# Altium schematic sheet power.SchDoc
size A4; Organization: Altium Limited; Address1: L3, 12a Rodborough Rd; Address2: Frenchs Forest; Address3: NSW; Address4: Australia 2086; SheetNumber: 6; SheetTotal: 8
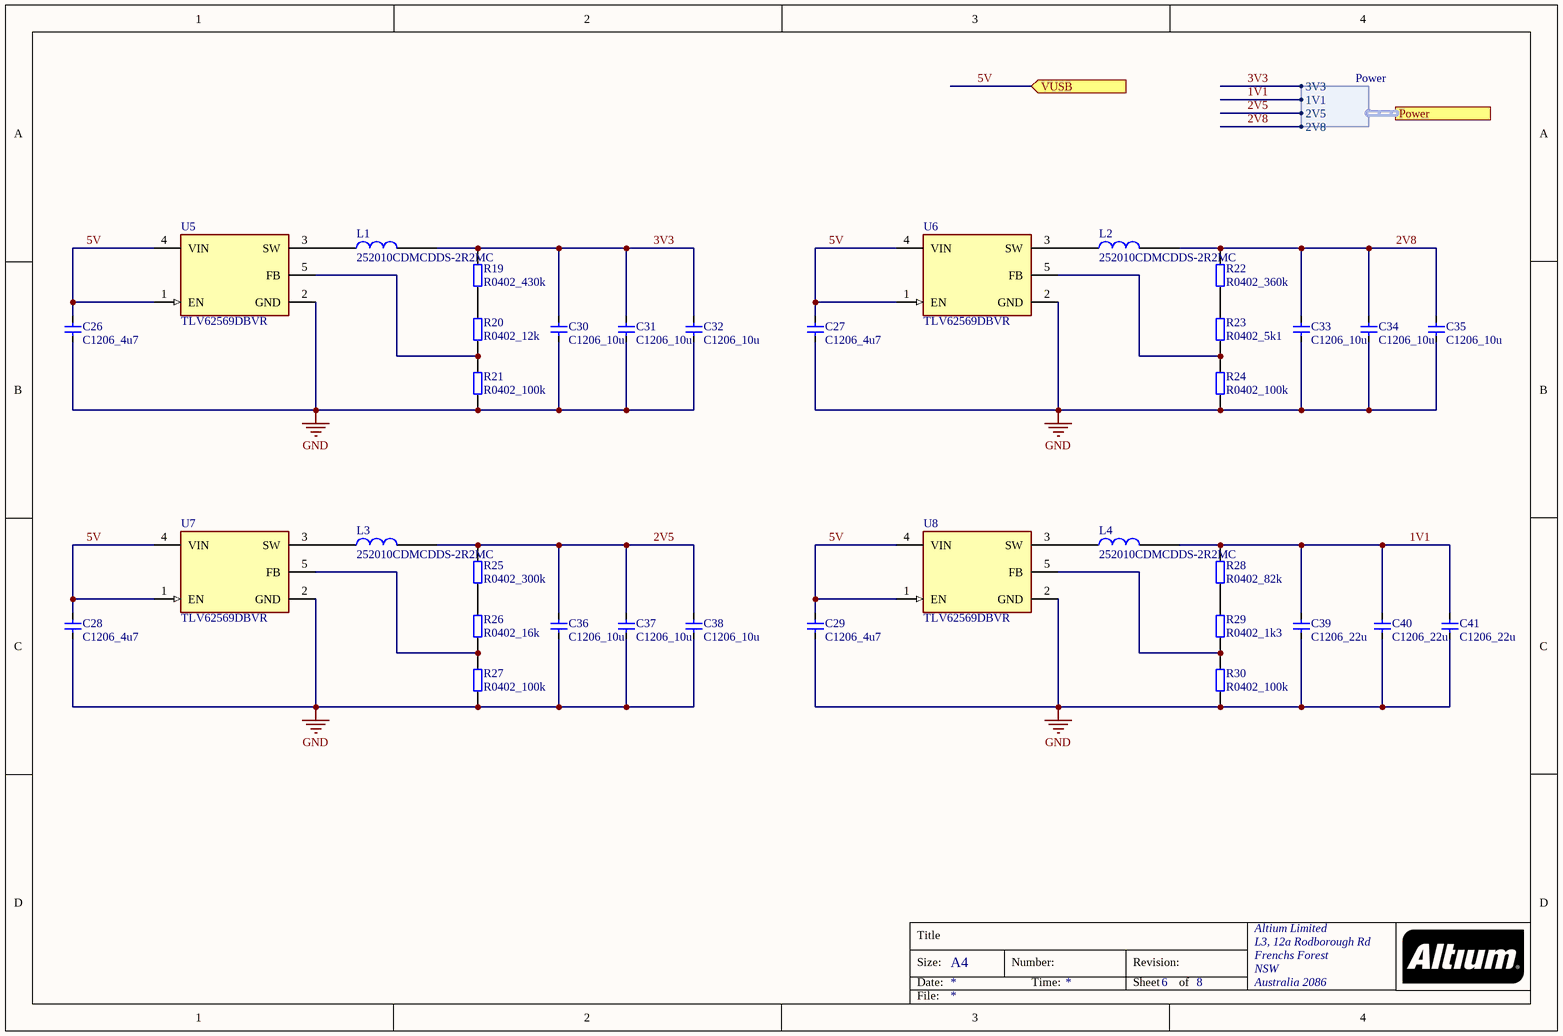
[diagram p0: power.SchDoc]

## Parts
C26  C1206_4u7  [C1206]
C27  C1206_4u7  [C1206]
C28  C1206_4u7  [C1206]
C29  C1206_4u7  [C1206]
C30  C1206_10u  [C1206]
C31  C1206_10u  [C1206]
C32  C1206_10u  [C1206]
C33  C1206_10u  [C1206]
C34  C1206_10u  [C1206]
C35  C1206_10u  [C1206]
C36  C1206_10u  [C1206]
C37  C1206_10u  [C1206]
C38  C1206_10u  [C1206]
C39  C1206_22u  [C1206]
C40  C1206_22u  [C1206]
C41  C1206_22u  [C1206]
L1  252010CDMCDDS-2R2MC  [INDC2520X10N]
L2  252010CDMCDDS-2R2MC  [INDC2520X10N]
L3  252010CDMCDDS-2R2MC  [INDC2520X10N]
L4  252010CDMCDDS-2R2MC  [INDC2520X10N]
R19  R0402_430k  [R0402]
R20  R0402_12k  [R0402]
R21  R0402_100k  [R0402]
R22  R0402_360k  [R0402]
R23  R0402_5k1  [R0402]
R24  R0402_100k  [R0402]
R25  R0402_300k  [R0402]
R26  R0402_16k  [R0402]
R27  R0402_100k  [R0402]
R28  R0402_82k  [R0402]
R29  R0402_1k3  [R0402]
R30  R0402_100k  [R0402]
U5  TLV62569DBVR  [FP-DBV0005A-MFG]
U6  TLV62569DBVR  [FP-DBV0005A-MFG]
U7  TLV62569DBVR  [FP-DBV0005A-MFG]
U8  TLV62569DBVR  [FP-DBV0005A-MFG]

## Ports
Power (harness Power), VUSB (in)

## Harnesses
Power: 3V3, 1V1, 2V5, 2V8

## Nets
GND: C26.2 C27.2 C28.2 C29.2 C30.2 C31.2 C32.2 C33.2 C34.2 C35.2 C36.2 C37.2 C38.2 C39.2 C40.2 C41.2 R21.1 R24.1 R27.1 R30.1 U5.2(GND) U6.2(GND) U7.2(GND) U8.2(GND)
1V1: C39.1 C40.1 C41.1 L4.2 R28.2 ; port Power.1V1
2V5: C36.1 C37.1 C38.1 L3.2 R25.2 ; port Power.2V5
2V8: C33.1 C34.1 C35.1 L2.2 R22.2 ; port Power.2V8
3V3: C30.1 C31.1 C32.1 L1.2 R19.2 ; port Power.3V3
5V: C26.1 C27.1 C28.1 C29.1 U5.1(EN) U5.4(VIN) U6.1(EN) U6.4(VIN) U7.1(EN) U7.4(VIN) U8.1(EN) U8.4(VIN) ; port VUSB
NetL1_1: L1.1 U5.3(SW)
NetL2_1: L2.1 U6.3(SW)
NetL3_1: L3.1 U7.3(SW)
NetL4_1: L4.1 U8.3(SW)
NetR19_1: R19.1 R20.2
NetR20_1: R20.1 R21.2 U5.5(FB)
NetR22_1: R22.1 R23.2
NetR23_1: R23.1 R24.2 U6.5(FB)
NetR25_1: R25.1 R26.2
NetR26_1: R26.1 R27.2 U7.5(FB)
NetR28_1: R28.1 R29.2
NetR29_1: R29.1 R30.2 U8.5(FB)

## Notes on the sheet
- Title
- Size:
- Date:
- A4
- Number:
- Time:
- Revision:
- Sheet
- of
- File:

## Library data of the parts
C26-C29 = CMP-003-0093-1: Manufacturer 1: Kemet; Manufacturer Part Number 1: C1206C475K4RAC; Voltage Rating DC: 16V; Dielectric: X7R; Tolerance: 0.1%; Hidden Value: C475; Value: 4u7; Component Type: Standard; Part Number: C1206_4u7; Pin Count: 2
C30-C38 = CMP-003-0097-1: Manufacturer 1: Kemet; Manufacturer Part Number 1: C1206C106K4RAC; Value: 10u; Hidden Value: C106; Tolerance: 0.1%; Dielectric: X7R; Voltage Rating DC: 16V; Part Number: C1206_10u; Pin Count: 2; Component Type: Standard
C39-C41 = CMP-003-0098-1: Manufacturer 1: Kemet; Manufacturer Part Number 1: C1206C226M8PAC; Hidden Value: C226; Dielectric: X5R; Tolerance: 0.2%; Voltage Rating DC: 10V; Value: 22u; Pin Count: 2; Part Number: C1206_22u; Component Type: Standard
L1-L4 = CMP-00003-2: Fixed Ind 2.2UH 2.5A 97 Mohm SMD
R19 = CMP-004-0482-1: Manufacturer Part Number 1: CRCW0402430KFKED; Manufacturer 1: Vishay; Tolerance: 1%; Value: 430k; Power Rating: 62,5mW; Component Type: Standard; Pin Count: 2; Part Number: R0402_430k
R20 = CMP-004-0445-1: Manufacturer 1: Vishay; Manufacturer Part Number 1: CRCW040212K0FKED; Power Rating: 62,5mW; Value: 12k; Tolerance: 1%; Part Number: R0402_12k; Component Type: Standard; Pin Count: 2
R21 R24 R27 R30 = CMP-004-0467-1: Manufacturer Part Number 1: CRCW0402100KFKED; Manufacturer 1: Vishay; Tolerance: 1%; Value: 100k; Power Rating: 62,5mW; Component Type: Standard; Part Number: R0402_100k; Pin Count: 2
R22 = CMP-004-0480-1: Manufacturer 1: Vishay; Manufacturer Part Number 1: CRCW0402360KFKED; Power Rating: 62,5mW; Tolerance: 1%; Value: 360k; Pin Count: 2; Component Type: Standard; Part Number: R0402_360k
R23 = CMP-004-0436-1: Manufacturer 1: Vishay; Manufacturer Part Number 1: CRCW04025K10FKED; Value: 5k1; Tolerance: 1%; Power Rating: 62,5mW; Pin Count: 2; Component Type: Standard; Part Number: R0402_5k1
R25 = CMP-004-0478-1: Manufacturer 1: Vishay; Manufacturer Part Number 1: CRCW0402300KFKED; Power Rating: 62,5mW; Tolerance: 1%; Value: 300k; Pin Count: 2; Component Type: Standard; Part Number: R0402_300k
R26 = CMP-004-0448-1: Manufacturer Part Number 1: CRCW040216K0FKED; Manufacturer 1: Vishay; Power Rating: 62,5mW; Tolerance: 1%; Value: 16k; Part Number: R0402_16k; Component Type: Standard; Pin Count: 2
R28 = CMP-004-0465-1: Manufacturer 1: Vishay; Manufacturer Part Number 1: CRCW040282K0FKED; Power Rating: 62,5mW; Value: 82k; Tolerance: 1%; Component Type: Standard; Pin Count: 2; Part Number: R0402_82k
R29 = CMP-004-0422-1: Manufacturer Part Number 1: CRCW04021K30FKED; Manufacturer 1: Vishay; Tolerance: 1%; Value: 1k3; Power Rating: 62,5mW; Pin Count: 2; Part Number: R0402_1k3; Component Type: Standard
U5-U8 = CMP-04918-000387-1: IC REG BUCK ADJ 2A SOT23-5; Output Configuration: Positive; Min Output Voltage: 600mV; Max Output Voltage: 5.5V; Switching Frequency: 1.5MHz; Output Type: Adjustable; Synchronous Rectifier: Yes; Min Input Voltage: 2.5V; Output Current: 2A; Mount: Surface Mount; Min Operating Temperature: -40°C; Max Operating Temperature: 125°C; RoHS Compliant: Yes; Max Input Voltage: 5.5V; Case/Package: SOT-23-5; Packaging: Cut Tape